# EAGLE board MbrdA_rev2.180 (EAGLE 7.2.0), part 1 of 2
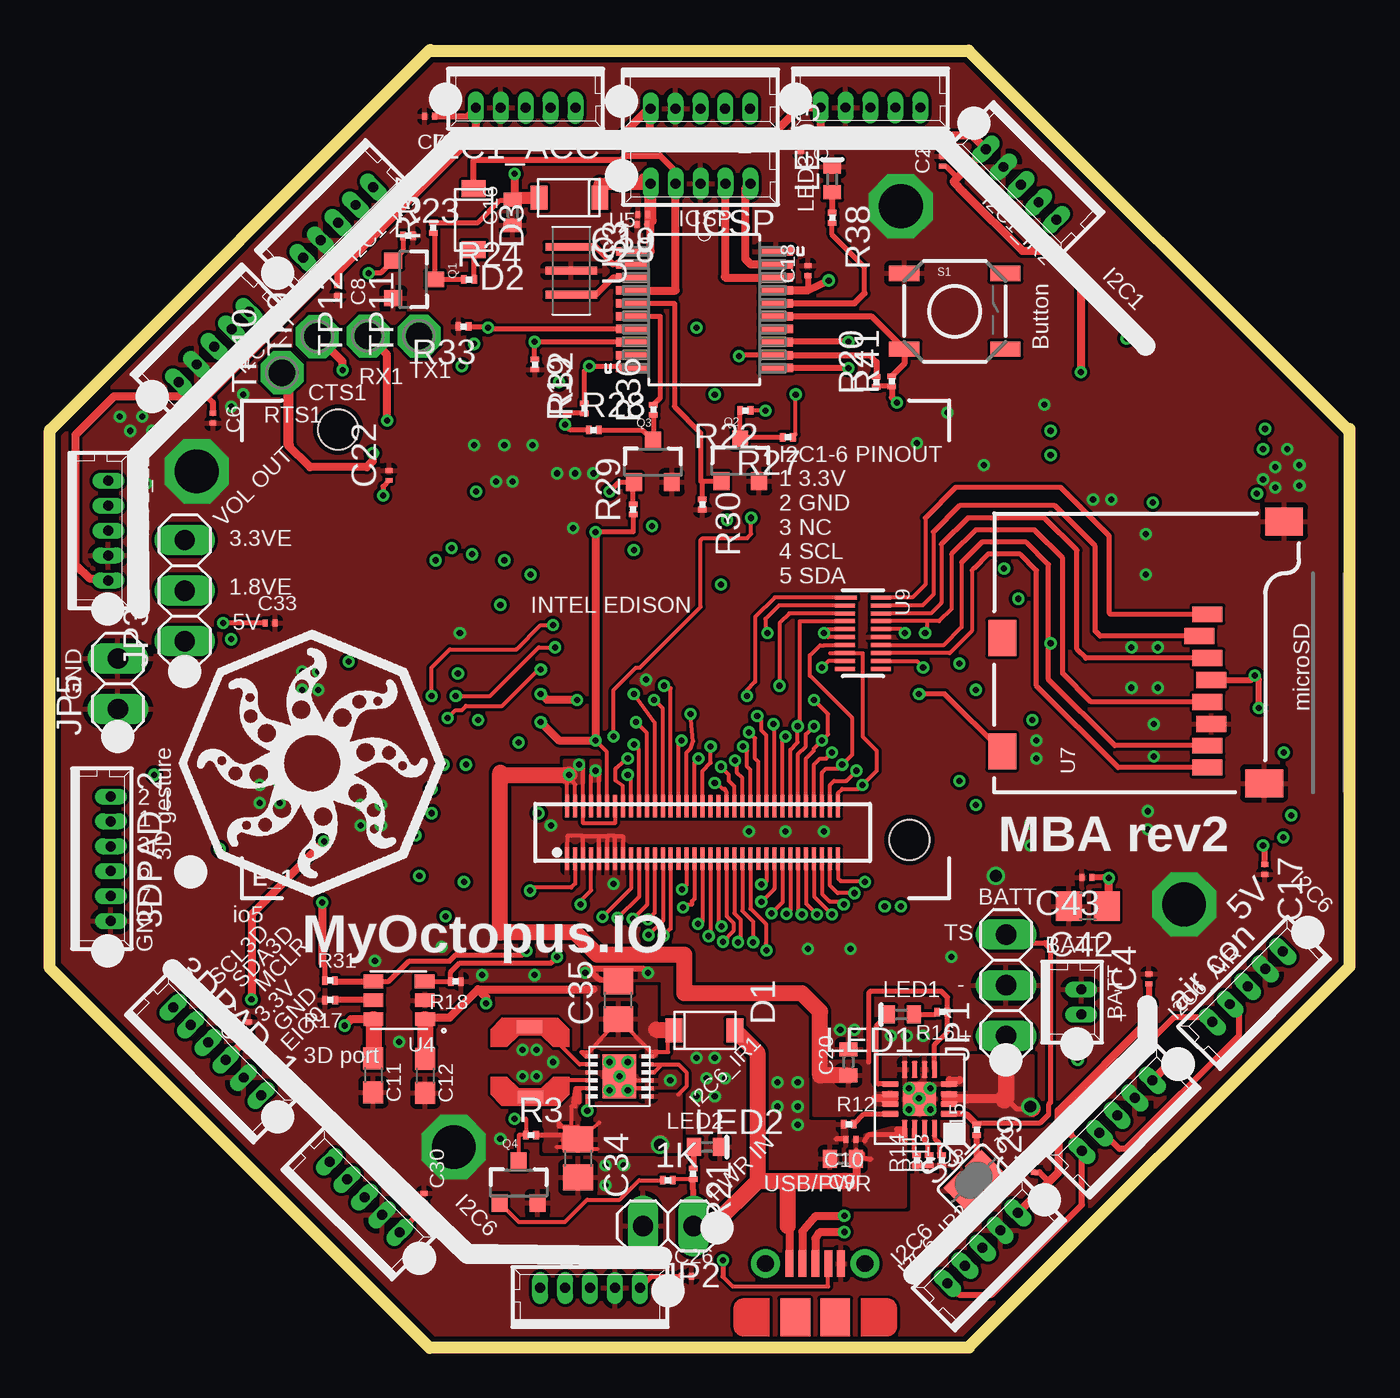
[diagram p7: board, top side]
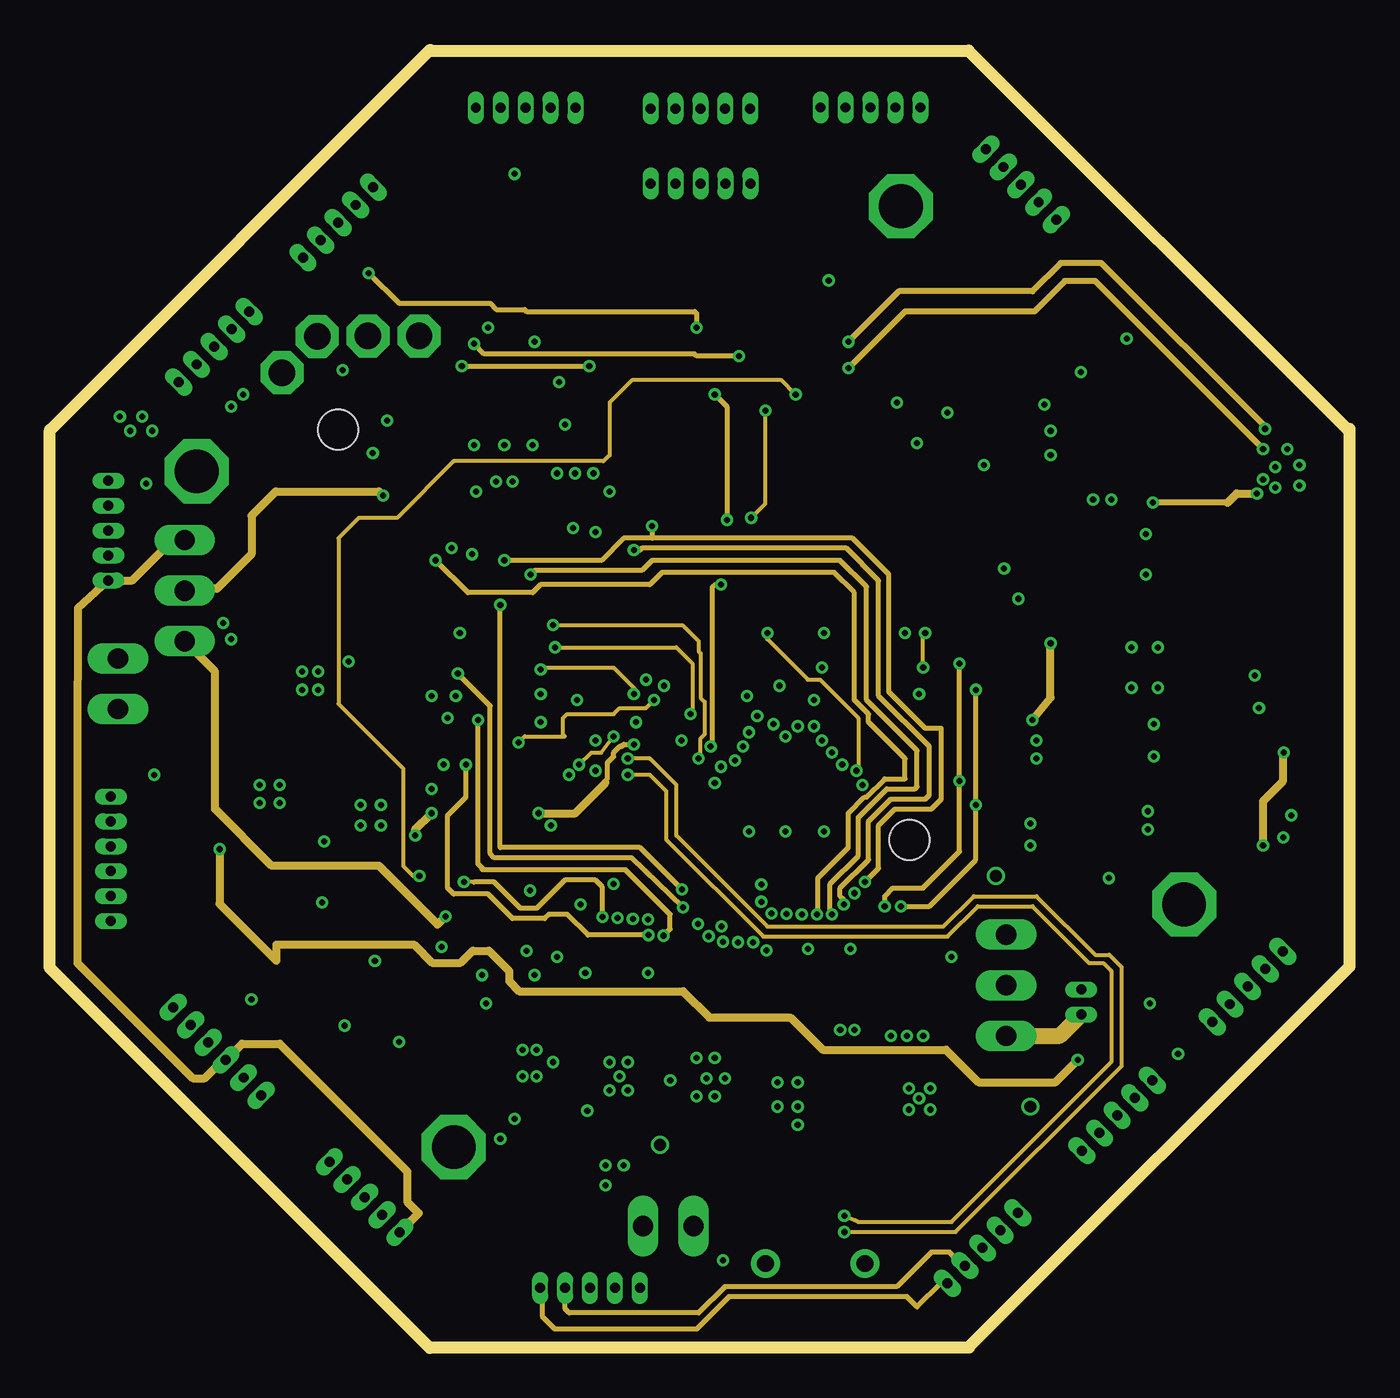
[diagram p8: board, inner layer Route2]
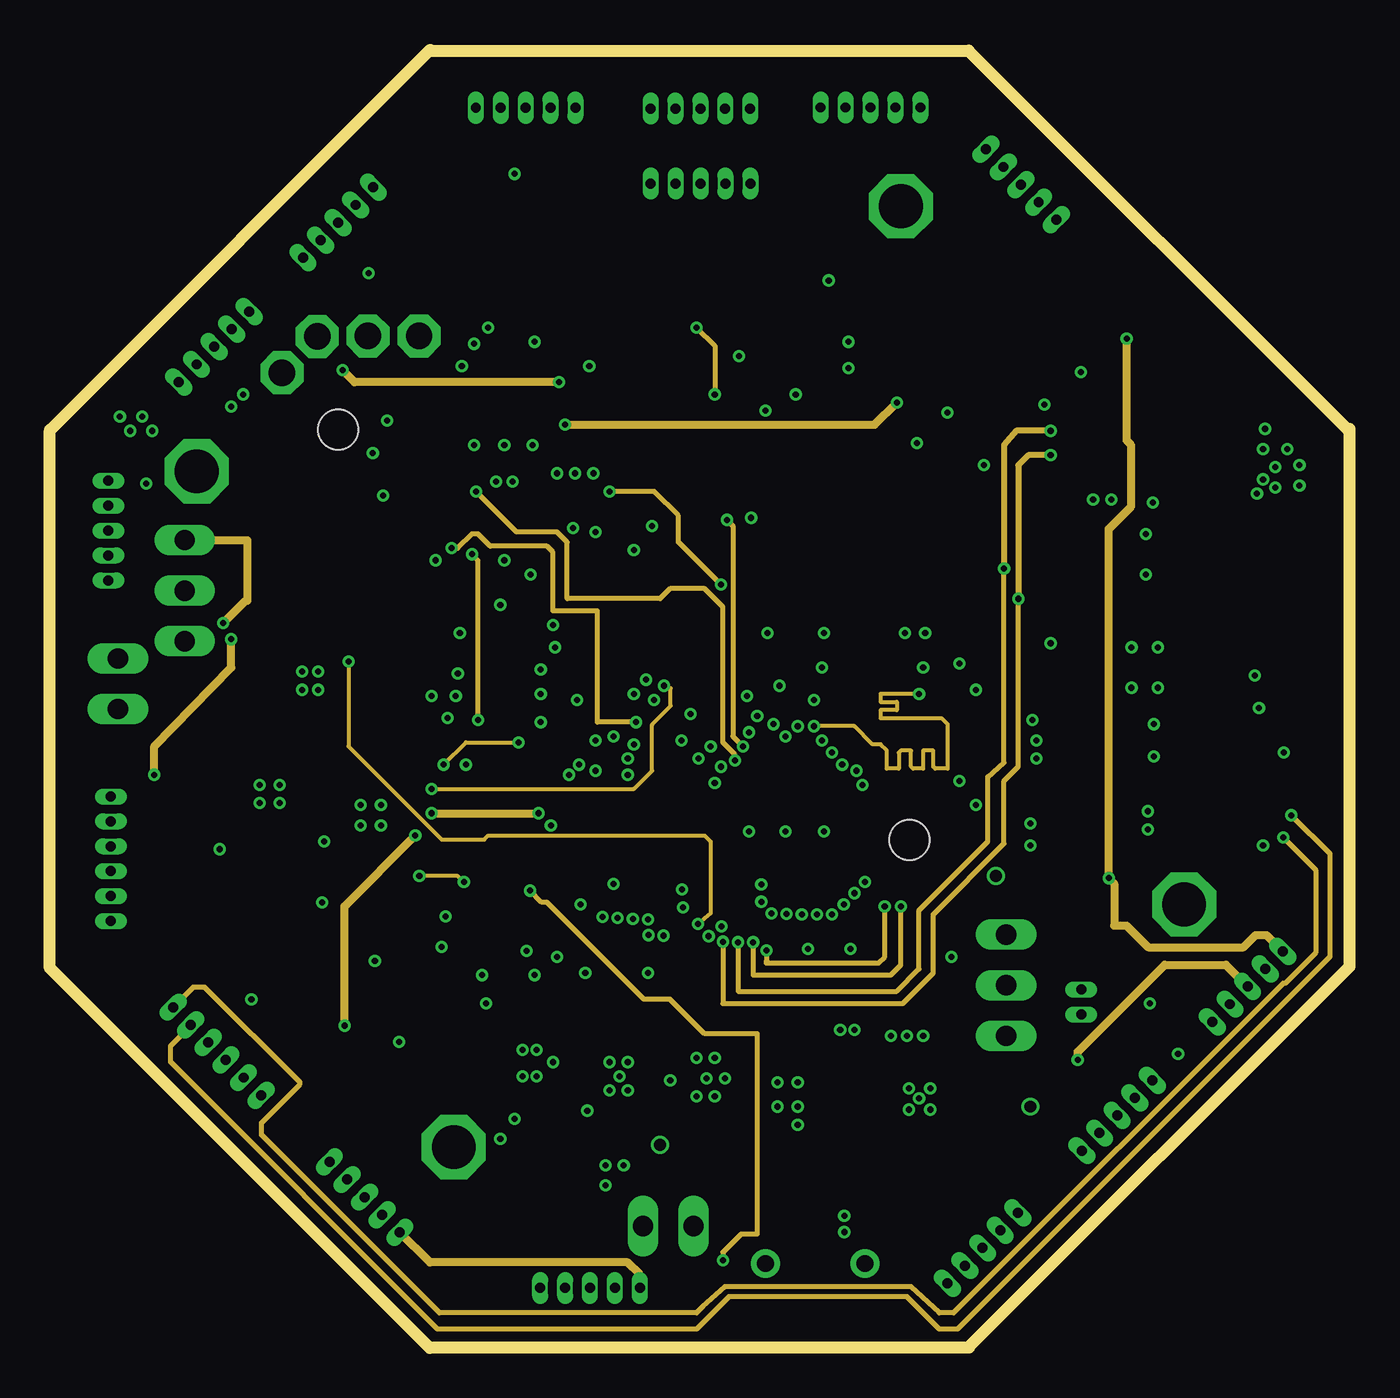
[diagram p9: board, inner layer Route15]
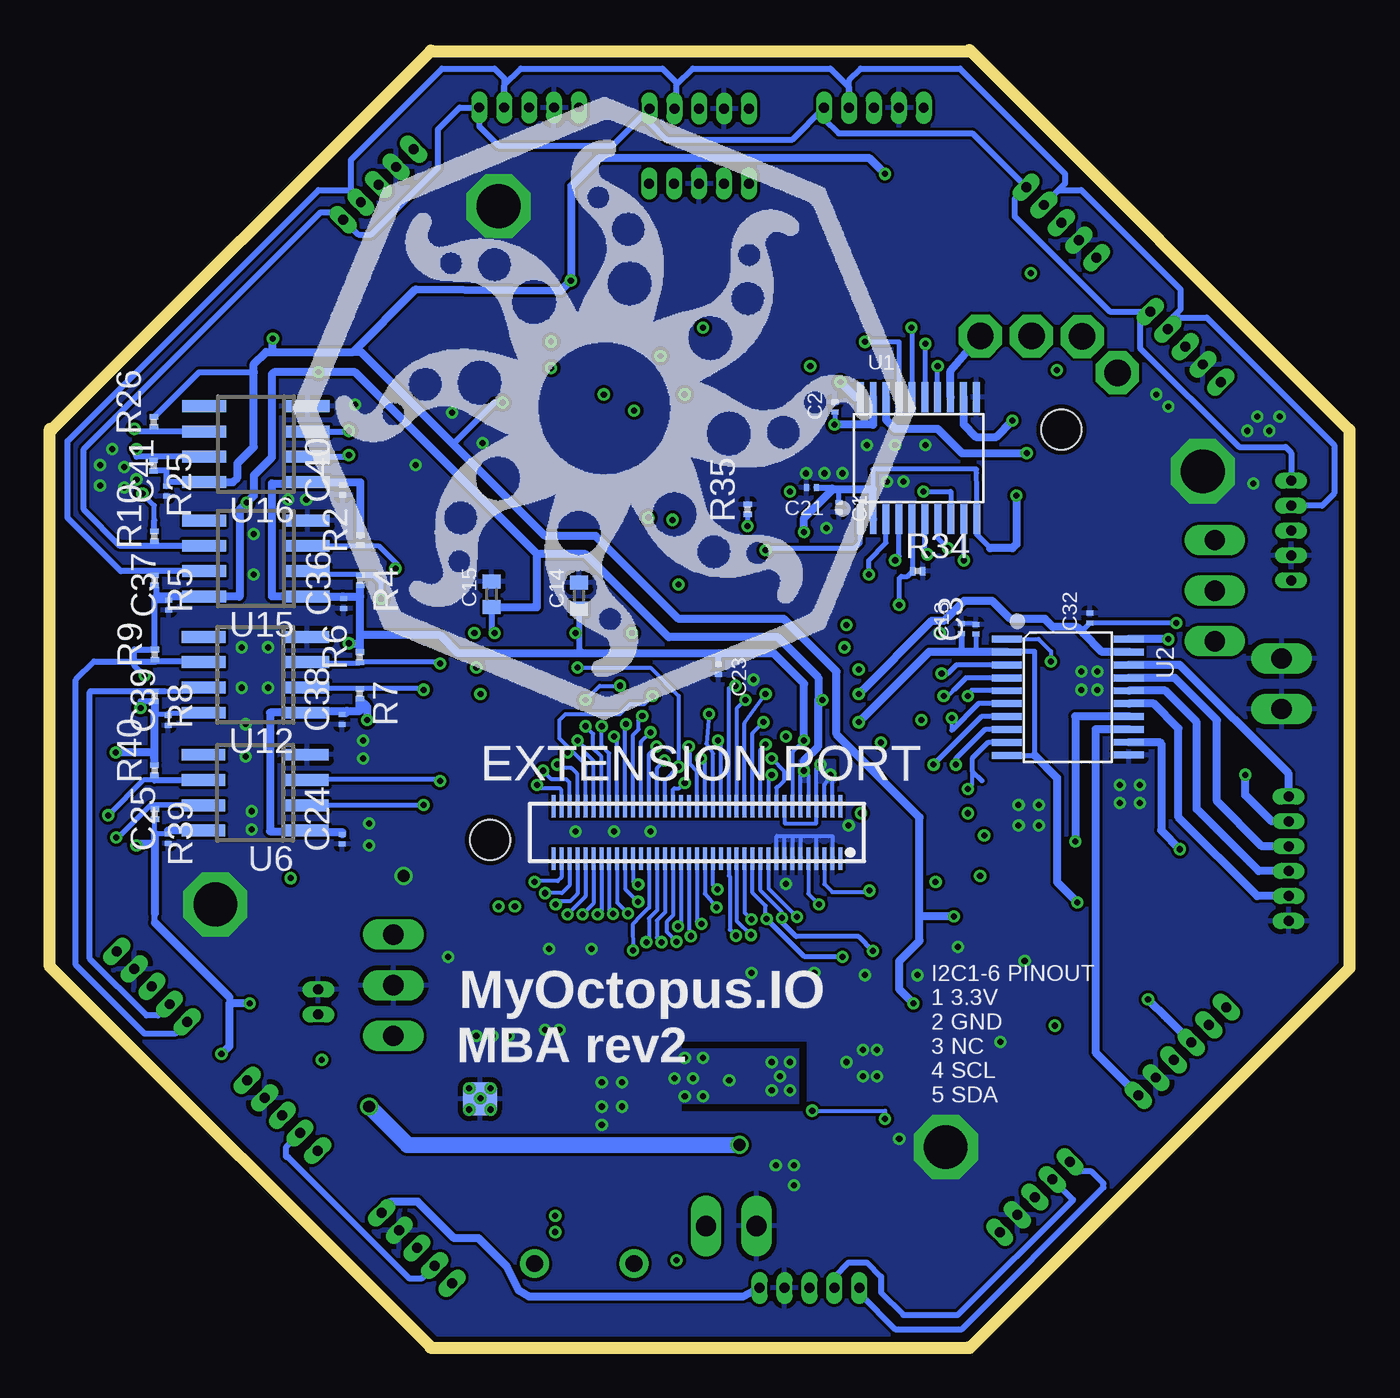
[diagram p10: board, bottom side, seen from below]

Size 65.28 x 65.2 mm. Coordinates in mm from the lower left corner, seen from the top.
Outline: 0,19.08 0,46.08
Outline: 19.09,0 0,19.09
Outline: 19.11,65.2 0.01,46.11
Outline: 46.13,65.13 19.13,65.13
Outline: 46.18,0.03 19.18,0.03
Outline: 46.13,65.16 65.23,46.07
Outline: 65.26,19.15 46.17,0.06
Outline: 65.28,19.16 65.28,46.16
Copper layers (1*2*15*16): Top 0.035mm / dielectric 0.2mm / Route2 0.0175mm / dielectric 0.3mm / Route15 0.0175mm / dielectric 0.2mm / Bottom 0.035mm
Design rules "SeeedStudio_4layer_DRU_no_angle_20140221 *": minimum track width 8mil, minimum drill 12mil, track to track 6mil, track to pad 6mil, pad to pad 6mil, via to via 6mil, smd to smd 0mil, copper to edge 10mil, drill to drill 8mil, minimum pad ring 6mil, minimum via ring 4mil, stop-mask expansion 4mil, vias tented up to drill 25mil, thermal gap 10mil
Net classes: 1 Vin5v: width 0.381 mm; 2 vsys: width 0.254 mm; 3 v_3.3V: width 0.254 mm; 4 v_1P80: width 0.254 mm; 5 screw: width 1.27 mm, drill 1.27 mm, clearance 0.254 mm

## Footprints (pad centres in the part's own frame; a part is rotated, then mirrored left to right if it is on the bottom)
R0201 = smd 0.28 x 0.43: 1 -0.255,0; 2 0.255,0
53047-06 = drill 0.5 pad 0.698 long: 1 3.125,0.45; 2 1.875,0.45; 3 0.625,0.45; 4 -0.625,0.45; 5 -1.875,0.45; 6 -3.125,0.45
53047-02 = drill 0.5 pad 0.698 long: 1 0.625,0.45; 2 -0.625,0.45
C0201 = smd 0.25 x 0.35: 1 -0.25,0; 2 0.25,0
C0402 = smd 0.7 x 0.9: 1 -0.65,0; 2 0.65,0
C0603 = smd 1.1 x 1: 1 -0.85,0; 2 0.85,0
C0805 = smd 1.3 x 1.5: 1 -0.95,0; 2 0.95,0
MINI-F3-B = smd 1.2 x 0.85: A 0,3.05; C 0,0
EDISON_DAUGHTER = smd 1.14 x 0.2: 1 1.98,19.17; 2 4.62,19.17; 3 1.98,18.77; 4 4.62,18.77; 5 1.98,18.37; 6 4.62,18.37; 7 1.98,17.97; 8 4.62,17.97; 9 1.98,17.57; 10 4.62,17.57; 11 1.98,17.17; 12 4.62,17.17; 13 1.98,16.77; 14 4.62,16.77; 15 1.98,16.37; 16 4.62,16.37; 17 1.98,15.97; 18 4.62,15.97; 19 1.98,15.57; 20 4.62,15.57; 21 1.98,15.17; 22 4.62,15.17; 23 1.98,14.77; 24 4.62,14.77; 25 1.98,14.37; 26 4.62,14.37; 27 1.98,13.97; 28 4.62,13.97; 29 1.98,13.57; 30 4.62,13.57; 31 1.98,13.17; 32 4.62,13.17; 33 1.98,12.77; 34 4.62,12.77; 35 1.98,12.37; 36 4.62,12.37; 37 1.98,11.97; 38 4.62,11.97; 39 1.98,11.57; 40 4.62,11.57; 41 1.98,11.17; 42 4.62,11.17; 43 1.98,10.77; 44 4.62,10.77; 45 1.98,10.37; 46 4.62,10.37; 47 1.98,9.97; 48 4.62,9.97; 49 1.98,9.57; 50 4.62,9.57; 51 1.98,9.17; 52 4.62,9.17; 53 1.98,8.77; 54 4.62,8.77; 55 1.98,8.37; 56 4.62,8.37; 57 1.98,7.97; 58 4.62,7.97; 59 1.98,7.57; 60 4.62,7.57; 61 1.98,7.17; 62 4.62,7.17; 63 1.98,6.77; 64 4.62,6.77; 65 1.98,6.37; 66 4.62,6.37; 67 1.98,5.97; 68 4.62,5.97; 69 1.98,5.57; 70 4.62,5.57 | hole 2: 23.53,30.67; 2.93,1.98
53047-05 = drill 0.5 pad 0.698 long: 1 2.5,0.45; 2 1.25,0.45; 3 0,0.45; 4 -1.25,0.45; 5 -2.5,0.45
1X03 = drill 1.016 long: 1 -2.54,0; 2 0,0; 3 2.54,0
1X02 = drill 1.016 long: 1 -1.27,0; 2 1.27,0
LPS4018 = smd 0.635 x 1.27: 1 0.44,1.37; 2 3.98,1.43
LED0402 = smd 0.7 x 0.9: A -0.65,0; C 0.65,0
SOT23-3 = smd 0.8 x 0.9: 1 -0.95,-1; 2 0.95,-1; 3 0,1.1
TACTILE_SWITCH_SMD = smd 1.524 x 0.762: 1 -2.54,1.905; 2 2.54,1.905; 3 -2.54,-1.905; 4 2.54,-1.905
SJ = smd 1.168 x 1.6: 1 -0.762,0; 2 0.762,0
P1-13 = drill 1.321 pad 2.159 octagon: TP 0,0
TSSOP20-0.65-6.5X4.4MM = smd 0.35 x 1.5: 1 -2.925,-3.065; 2 -2.275,-3.065; 3 -1.625,-3.065; 4 -0.975,-3.065; 5 -0.325,-3.065; 6 0.325,-3.065; 7 0.975,-3.065; 8 1.625,-3.065; 9 2.275,-3.065; 10 2.925,-3.065; 11 2.91,3.065; 12 2.26,3.065; 13 1.61,3.065; 14 0.96,3.065; 15 0.325,3.065; 16 -0.325,3.065; 17 -0.975,3.065; 18 -1.625,3.065; 19 -2.275,3.065; 20 -2.925,3.065
QFN-16_BOT_PAD = smd 0.85 x 0.28: 1 -1.475,0.75; 2 -1.475,0.25; 3 -1.475,-0.25; 4 -1.475,-0.75; 9 1.475,-0.75; 10 1.475,-0.25; 11 1.475,0.25; 12 1.475,0.75 | smd 0.28 x 0.85: 5 -0.75,-1.475; 6 -0.25,-1.475; 7 0.25,-1.475; 8 0.75,-1.475; 13 0.75,1.475; 14 0.25,1.475; 15 -0.25,1.475; 16 -0.75,1.475 | smd 1.7 x 1.7: PAD0 0,0 | smd 1.7 x 1.7 bottom: PAD1 0,0
SOT23-6L = smd 0.99 x 0.69: 1 0,0; 2 0.01,-0.95; 3 0.02,-1.9; 4 2.59,-1.9; 5 2.59,-0.95; 6 2.59,0
SOP65P780X200-20N = smd 1.676 x 0.432: 1 -3.607,2.921; 2 -3.607,2.286; 3 -3.607,1.626; 4 -3.607,0.965; 5 -3.607,0.33; 6 -3.607,-0.33; 7 -3.607,-0.965; 8 -3.607,-1.626; 9 -3.607,-2.286; 10 -3.607,-2.921; 11 3.607,-2.921; 12 3.607,-2.286; 13 3.607,-1.626; 14 3.607,-0.965; 15 3.607,-0.33; 16 3.607,0.33; 17 3.607,0.965; 18 3.607,1.626; 19 3.607,2.286; 20 3.607,2.921
SO-08 = smd 0.6 x 2.2: 1 -1.905,-2.6; 2 -0.635,-2.6; 3 0.635,-2.6; 4 1.905,-2.6; 5 1.905,2.6; 6 0.635,2.6; 7 -0.635,2.6; 8 -1.905,2.6
MICRO-SD-SOCKET-PP = smd 0.8 x 1.5: 1 -8.94,10.7; 2 -7.84,10.3; 3 -6.74,10.7; 4 -5.64,10.9; 5 -4.54,10.7; 6 -3.44,10.9; 7 -2.34,10.7; 8 -1.24,10.7 | smd 1.8 x 1.4: CD1 -2.05,0.4; CD2 -7.75,0.4 | smd 1.4 x 1.9: GND1 -13.6,14.55; GND3 -0.45,13.55
DF40C-70DP-0.4(51) = smd 0.2 x 1.14 bottom: 1 6.8,1.32; 2 6.8,-1.32; 3 6.4,1.32; 4 6.4,-1.32; 5 6,1.32; 6 6,-1.32; 7 5.6,1.32; 8 5.6,-1.32; 9 5.2,1.32; 10 5.2,-1.32; 11 4.8,1.32; 12 4.8,-1.32; 13 4.4,1.32; 14 4.4,-1.32; 15 4,1.32; 16 4,-1.32; 17 3.6,1.32; 18 3.6,-1.32; 19 3.2,1.32; 20 3.2,-1.32; 21 2.8,1.32; 22 2.8,-1.32; 23 2.4,1.32; 24 2.4,-1.32; 25 2,1.32; 26 2,-1.32; 27 1.6,1.32; 28 1.6,-1.32; 29 1.2,1.32; 30 1.2,-1.32; 31 0.8,1.32; 32 0.8,-1.32; 33 0.4,1.32; 34 0.4,-1.32; 35 0,1.32; 36 0,-1.32; 37 -0.4,1.32; 38 -0.4,-1.32; 39 -0.8,1.32; 40 -0.8,-1.32; 41 -1.2,1.32; 42 -1.2,-1.32; 43 -1.6,1.32; 44 -1.6,-1.32; 45 -2,1.32; 46 -2,-1.32; 47 -2.4,1.32; 48 -2.4,-1.32; 49 -2.8,1.32; 50 -2.8,-1.32; 51 -3.2,1.32; 52 -3.2,-1.32; 53 -3.6,1.32; 54 -3.6,-1.32; 55 -4,1.32; 56 -4,-1.32; 57 -4.4,1.32; 58 -4.4,-1.32; 59 -4.8,1.32; 60 -4.8,-1.32; 61 -5.2,1.32; 62 -5.2,-1.32; 63 -5.6,1.32; 64 -5.6,-1.32; 65 -6,1.32; 66 -6,-1.32; 67 -6.4,1.32; 68 -6.4,-1.32; 69 -6.8,1.32; 70 -6.8,-1.32; NC1 7.2,1.32; NC2 7.2,-1.32; NC3 -7.2,-1.32; NC4 -7.2,1.32
UFDFN-20 = smd 0.2 x 1.1: P$1 -1.8,-0.85 | smd 0.2 x 1: P$2 -1.4,-0.9; P$3 -1,-0.9; P$4 -0.6,-0.9; P$5 -0.2,-0.9; P$6 0.2,-0.9; P$7 0.6,-0.9; P$8 1,-0.9; P$9 1.4,-0.9; P$10 1.8,-0.9; P$11 1.8,0.9; P$12 1.4,0.9; P$13 1,0.9; P$14 0.6,0.9; P$15 0.2,0.9; P$16 -0.2,0.9; P$17 -0.6,0.9; P$18 -1,0.9; P$19 -1.4,0.9; P$20 -1.8,0.9
LLP.12.3X3MM = smd 0.2 x 0.6: 1 -1,-1.4; 2 -0.6,-1.4; 3 -0.2,-1.4; 4 0.2,-1.4; 5 0.6,-1.4; 6 1,-1.4; 7 1,1.4; 8 0.6,1.4; 9 0.2,1.4; 10 -0.2,1.4; 11 -0.6,1.4; 12 -1,1.4 | smd 2.2 x 1.68: PAD 0,0
USB-MICRO-MOLEX-105017-0001 = smd 0.4 x 1.35: 1 1.2,0; 2 1.85,0; 3 2.5,0; 4 3.15,0; 5 3.8,0 | drill 0.85 pad 1.45: P$1 0,0; P$2 5,0 | smd 1.5 x 1.9: P$3 3.5,-2.7; P$4 1.5,-2.7
CSTER12M = smd 0.4 x 2.6: 1 -1.2,0; 2 0,0; 3 1.2,0

## Placement (x,y rotation side)
1K  10k  [R0201]  31.04,8.44 0 top
3DPAD_1  53047-06  [53047-06]  8.08,14.59 315 top
3DPAD_2  53047-06  [53047-06]  2.62,24.58 270 top
BATT  53047-02  [53047-02]  51.34,17.38 270 top
C1  100n  [C0201]  25.65,42.22 270 bottom
C2  100n  [C0201]  25.86,47.26 90 bottom
C3  100n  [C0201]  18.78,36.1 90 bottom
C4  100n  [C0201]  55.19,18.54 90 top
C5  100n  [C0201]  37.71,60.33 270 top
C6  100n  [C0201]  8.19,46.7 270 top
C7  100n  [C0201]  19.07,61.86 180 top
C8  100n  [C0201]  14.46,53.11 270 top
C9  10uF  [C0402]  39.83,9.5 180 top
C10  100n  [C0201]  40.23,10.49 180 top
C11  2.2u  [C0603]  16.24,13.71 270 top
C12  2.2u  [C0603]  18.85,13.68 270 top
C13  100n  [C0201]  19.49,36.14 90 bottom
C14  10uF  [C0402]  38.7,37.8 90 bottom
C15  10uF  [C0402]  43.09,37.86 90 bottom
C16  10uF  [C0402]  23.25,57.03 90 top
C17  100n  [C0201]  61,24.03 270 top
C18  100n  [C0201]  38.06,54.11 90 top
C19  100n  [C0201]  29.78,56.93 180 top
C20  10u  [C0402]  40.11,14.35 90 top
C21  100n  [C0201]  27.04,43.22 180 bottom
C22  100n  [C0201]  17.03,43.83 90 top
C23  100n  [C0201]  31.7,34.07 270 bottom
C24  100n  [C0201]  50.6,25.56 90 bottom
C25  100n  [C0201]  59.33,25.58 90 bottom
C26  100n  [C0201]  31.98,3.61 0 top
C27  100n  [C0201]  44.83,59.6 90 top
C28  100n  [C0201]  29.73,56.43 180 top
C29  100n  [C0201]  49.45,9.08 90 top
C30  100n  [C0201]  18.8,7.52 90 top
C31  100n  [C0201]  9.99,16.13 90 top
C32  100n  [C0201]  13.06,36.66 90 bottom
C33  100n  [C0201]  11.07,36.4 0 top
C34  10uF  [C0805]  26.53,9.53 270 top
C35  22uF  [C0805]  28.55,17.47 90 top
C36  100n  [C0201]  50.53,37.39 90 bottom
C37  100n  [C0201]  59.32,37.32 90 bottom
C38  100n  [C0201]  50.6,31.58 90 bottom
C39  100n  [C0201]  59.34,31.53 90 bottom
C40  100n  [C0201]  50.58,43.08 90 bottom
C41  100n  [C0201]  59.42,43.03 90 bottom
C42  10uF  [C0805]  52.12,22.19 180 top
C43  100n  [C0201]  52.09,23.64 180 top
D1  [MINI-F3-B]  31.35,15.96 270 top
D2  [MINI-F3-B]  21.29,58.21 180 top
D3  [MINI-F3-B]  27.62,57.76 90 top
E_1  EDISON_CONNECTOR_SEGMENTED  [EDISON_DAUGHTER]  45.15,22.59 90 top
I2C1_ACC  53047-05  [53047-05]  23.89,62.74 180 top
I2C1_H  I2C1_H  [53047-05]  7.93,50.6 225 top
I2C1_IR1  53047-05  [53047-05]  14.16,56.84 225 top
I2C1_IR2  53047-05  [53047-05]  49.09,58.75 135 top
I2C1_L1  53047-05  [53047-05]  2.49,41.06 270 top
I2C1_L2  53047-05  [53047-05]  32.67,62.7 180 top
I2C1_P  53047-05  [53047-05]  41.21,62.75 180 top
I2C6_AIR  53047-05  [53047-05]  60.47,17.84 45 top
I2C6_IR1  53047-05  [53047-05]  15.49,7.27 315 top
I2C6_IR2  53047-05  [53047-05]  47.16,4.71 45 top
I2C6_L1  53047-05  [53047-05]  27.13,2.57 0 top
I2C6_L2  53047-05  [53047-05]  53.92,11.37 45 top
ICSP  53047-05  [53047-05]  32.68,58.93 180 top
JP1  [1X03]  48.02,18.23 90 top
JP2  [1X02]  31.06,6.14 180 top
JP3  [1X03]  6.77,38.04 90 top
JP5  [1X02]  3.42,33.36 90 top
L1  2.2uH  [LPS4018]  25.51,12.17 90 top
LED1  green  [LED0402]  42.75,16.76 180 top
LED2  orange  [LED0402]  33.01,10.1 0 top
LED3  red  [LED0402]  39.29,58.69 90 top
Q1  200mA/50V  [SOT23-3]  18.25,53.67 270 top
Q2  200mA/50V  [SOT23-3]  34.67,44.53 0 top
Q3  200mA/50V  [SOT23-3]  30.28,44.48 0 top
Q4  200mA/50V  [SOT23-3]  23.55,8.29 0 top
R2  4.7k  [R0201]  49.69,40.57 90 bottom
R3  10k  [R0201]  24.16,10.7 0 top
R4  4.7k  [R0201]  49.68,38.55 270 bottom
R5  4.7k  [R0201]  60.02,38.55 270 bottom
R6  4.7k  [R0201]  49.72,34.7 90 bottom
R7  4.7k  [R0201]  49.71,32.86 270 bottom
R8  4.7k  [R0201]  60.02,32.74 270 bottom
R9  4.7k  [R0201]  60,34.83 90 bottom
R10  4.7k  [R0201]  60.03,40.77 90 bottom
R11  2k  [R0201]  44.17,9.44 90 top
R12  1.62k  [R0201]  40.12,11.25 0 top
R13  4.7k  [R0201]  44.79,9.43 90 top
R14  47k  [R0201]  43.54,9.43 90 top
R15  10k  [R0201]  46.55,10.96 90 top
R16  576  [R0201]  44.82,16.88 180 top
R17  576  [R0201]  14.08,17.48 180 top
R18  100k  [R0201]  20.39,18.41 180 top
R19  10k  [R0201]  26.85,47.2 90 top
R20  10k  [R0201]  41.5,48.52 90 top
R21  576  [R0201]  32.31,8.75 270 top
R22  10k  [R0201]  34.93,47.09 180 top
R23  10k  [R0201]  17.99,55.86 0 top
R24  1k  [R0201]  21.06,53.67 0 top
R25  4.7k  [R0201]  60.07,44.32 270 bottom
R26  4.7k  [R0201]  60.05,46.51 90 bottom
R27  220  [R0201]  37.07,45.74 180 top
R28  10k  [R0201]  27.31,46.11 0 top
R29  10k  [R0201]  29.29,42.12 90 top
R30  10k  [R0201]  32.77,42.36 270 top
R31  10k  [R0201]  14.07,18.46 0 top
R32  10k  [R0201]  24.37,49.4 270 top
R33  10k  [R0201]  20.78,51.31 180 top
R34  10k  [R0201]  21.69,39.02 0 bottom
R35  10k  [R0201]  30.23,42.12 90 bottom
R36  1k  [R0201]  30.31,47.12 90 top
R37  10k  [R0201]  19.25,56.27 90 top
R38  576  [R0201]  39.29,56.76 270 top
R39  1.8k  [R0201]  60,26.82 270 bottom
R40  1.8k  [R0201]  60.02,29.01 90 bottom
R41  10k  [R0201]  42.28,48.56 90 top
S1  SWITCH-MOMENTARY-2SMD  [TACTILE_SWITCH_SMD]  45.45,52.07 0 top
SJ1  open  [SJ]  46.4,8.43 45 top
TP9  TPSQPAD1-13  [P1-13]  13.44,50.81 90 top
TP10  TPSQPAD1-13  [P1-13]  11.66,48.98 90 top
TP11  TPSQPAD1-13  [P1-13]  18.54,50.83 90 top
TP12  TPSQPAD1-13  [P1-13]  15.98,50.83 90 top
U1  LOGIC-TXS0108EPWR(TSSOP20)  [TSSOP20-0.65-6.5X4.4MM]  21.65,44.69 0 bottom
U2  LOGIC-TXS0108EPWR(TSSOP20)  [TSSOP20-0.65-6.5X4.4MM]  14.16,32.69 270 bottom
U3  BQ24074  [QFN-16_BOT_PAD]  43.68,12.51 180 top
U4  MIC2039EYM6  [SOT23-6L]  18.84,16.52 180 top
U5  PIC18F14K50-I/SS  [SOP65P780X200-20N]  32.87,52.14 0 top
U6  TCA9517  [SO-08]  54.97,27.89 90 bottom
U7  USD-SOCKETNEW  [MICRO-SD-SOCKET-PP]  47.43,27.91 270 top
U8  EDISON_CONNECTOR_FULLHEADER  [DF40C-70DP-0.4(51)]  32.78,25.9 180 top
U9  TXB0108  [UFDFN-20]  40.83,35.9 270 top
U11  LM3668  [LLP.12.3X3MM]  28.61,13.65 270 top
U12  TCA9517  [SO-08]  54.95,33.81 90 bottom
U15  TCA9517  [SO-08]  54.92,39.65 90 bottom
U16  TCA9517  [SO-08]  54.92,45.4 90 bottom
U$1  USB-CON-5PIN-105017-0001  [USB-MICRO-MOLEX-105017-0001]  35.94,4.25 0 top
U$3  CSTCE20M0V53-R0  [CSTER12M]  26.19,54.1 270 top